# Altium schematic sheet Day10F206.SchDoc
size B
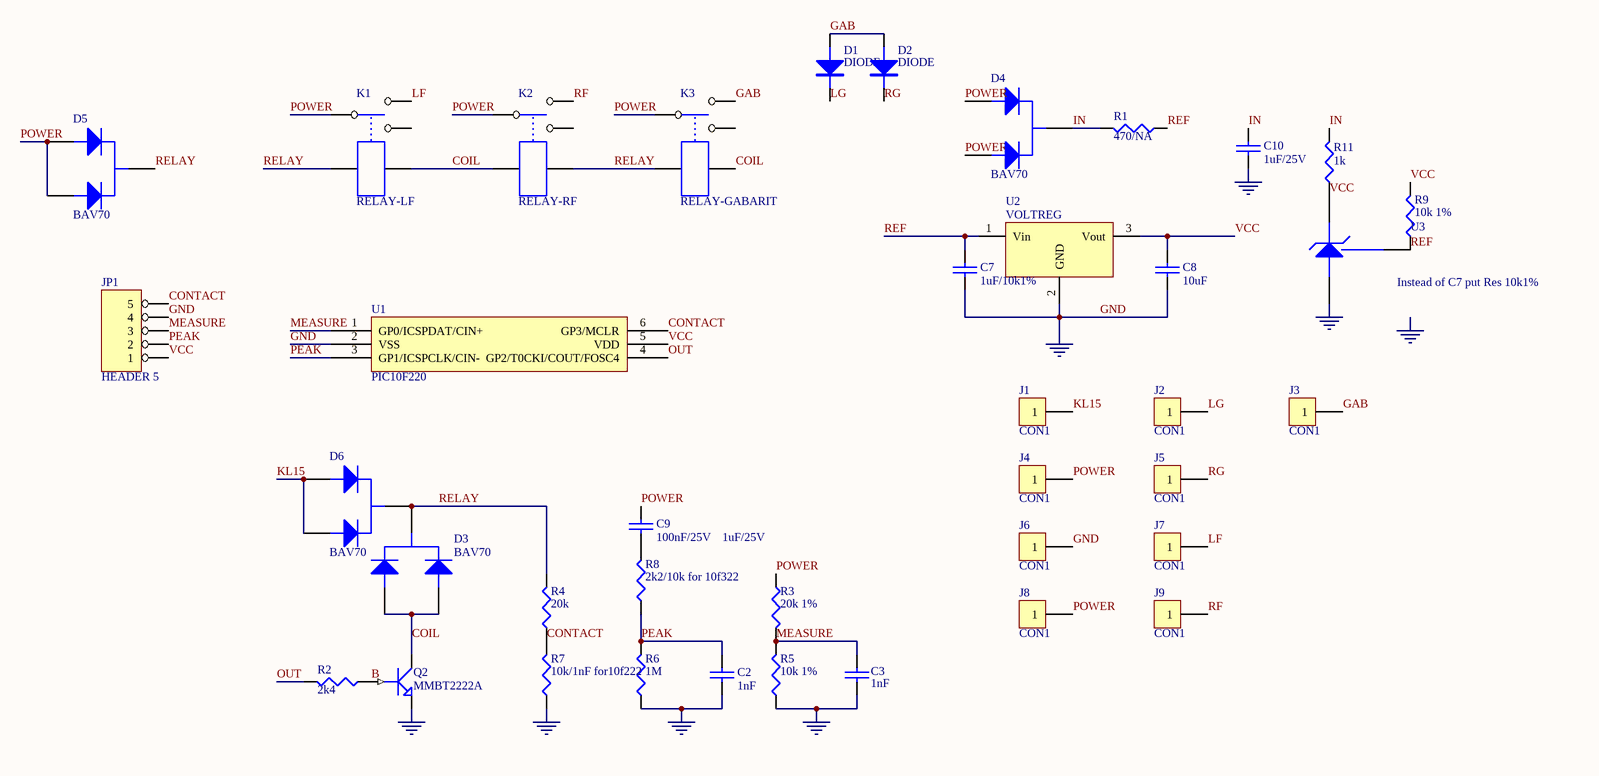
[diagram p0: Day10F206.SchDoc]

## Parts
C2  1nF  [0603]
C3  1nF  [0603]
C7  1uF/10k1%  [0805]
C8  10uF  [0805]
C9  100nF/25V  [0603]
C10  1uF/25V  [0805]
D1  DIODE  [SMC]
D2  DIODE  [SMC]
D3  BAV70  [SOT-23]
D4  BAV70  [SOT-23]
D5  BAV70  [SOT-23]
D6  BAV70  [SOT-23]
J1  CON1  [SIP1 - WIRE]
J2  CON1  [SIP1 - WIRE]
J3  CON1  [SIP1 - WIRE]
J4  CON1  [SIP1 - WIRE]
J5  CON1  [SIP1 - WIRE]
J6  CON1  [SIP1 - WIRE]
J7  CON1  [SIP1 - WIRE]
J8  CON1  [SIP1 - WIRE]
J9  CON1  [SIP1 - WIRE]
JP1  HEADER 5  [SIP5 - PGM]
K1  RELAY-LF  [RELAY5PIN]
K2  RELAY-RF  [RELAY5PIN]
K3  RELAY-GABARIT  [RELAY5PIN]
Q2  MMBT2222A  [SOT-23]
R1  470/NA  [0603]
R2  2k4  [0603]
R3  20k 1%  [0603]
R4  20k  [0603]
R5  10k 1%  [0603]
R6  1M  [0603]
R7  10k/1nF for10f222  [0603]
R8  2k2/10k for 10f322  [0603]
R9  10k 1%  [0603]
R11  1k  [0603]
U1  PIC10F220  [SOT23 - 6]
U2  VOLTREG  [SO-8 VOLTREG]
U3  TL431  [SOT-23]  (value not drawn)

## Nets
GND: C2.2 C3.1 C7.2 C8.2 C10.2 J6.1 JP1.4 Q2.3(E) R5.1 R6.1 R7.1 U1.2(VSS) U2.2(GND) U3.2(A)
B: Q2.1(B) R2.1
COIL: D3.1(A1) D3.3(A2) K1.5 K2.4 K3.5 Q2.2(C)
CONTACT: JP1.5 R4.1 R7.2 U1.6(GP3/MCLR)
GAB: D1.2(A) D2.2(A) J3.1 K3.2
IN: C10.1 D4.2(K) R1.2 R11.2
KL15: D6.1(A1) D6.3(A2) J1.1
LF: J7.1 K1.2
LG: D1.1(K) J2.1
MEASURE: C3.2 JP1.3 R3.2 R5.2 U1.1(GP0/ICSPDAT/CIN+)
OUT: R2.2 U1.4(GP2/T0CKI/COUT/FOSC4)
PEAK: C2.1 JP1.2 R6.2 R8.1 U1.3(GP1/ICSPCLK/CIN-)
POWER: C9.1 D4.1(A1) D4.3(A2) D5.1(A1) D5.3(A2) J4.1 J8.1 K1.1 K2.1 K3.1 R3.1
REF: C7.1 R1.1 R9.1 U2.1(Vin) U3.1(REF)
RELAY: D3.2(K) D5.2(K) D6.2(K) K1.4 K2.5 K3.4 R4.2
RF: J9.1 K2.2
RG: D2.1(K) J5.1
VCC: C8.1 JP1.1 R9.2 R11.1 U1.5(VDD) U2.3(Vout) U3.3(K)
NetC9_2: C9.2 R8.2

Not connected (* = marked no-connect by the designer): K1 3; K2 3; K3 3

## Notes on the sheet
- (near U3) Instead of C7 put Res 10k1%
- (near R3) 1uF/25V
- Labels drawn without touching a wire or pin: GND

## Library data of the parts
C2 C3 C7-C10 = CAP: Capacitor
D3-D6 = DUAL DIODE BAV70
J1-J9 = CON1: Connector
K1-K3 = RELAY-SPDT
Q2 = NPN1: NPN Transistor
R1-R9 R11 = RES1
U1 = PIC10F206